# EAGLE design e21-hw (EAGLE 9.6.2)
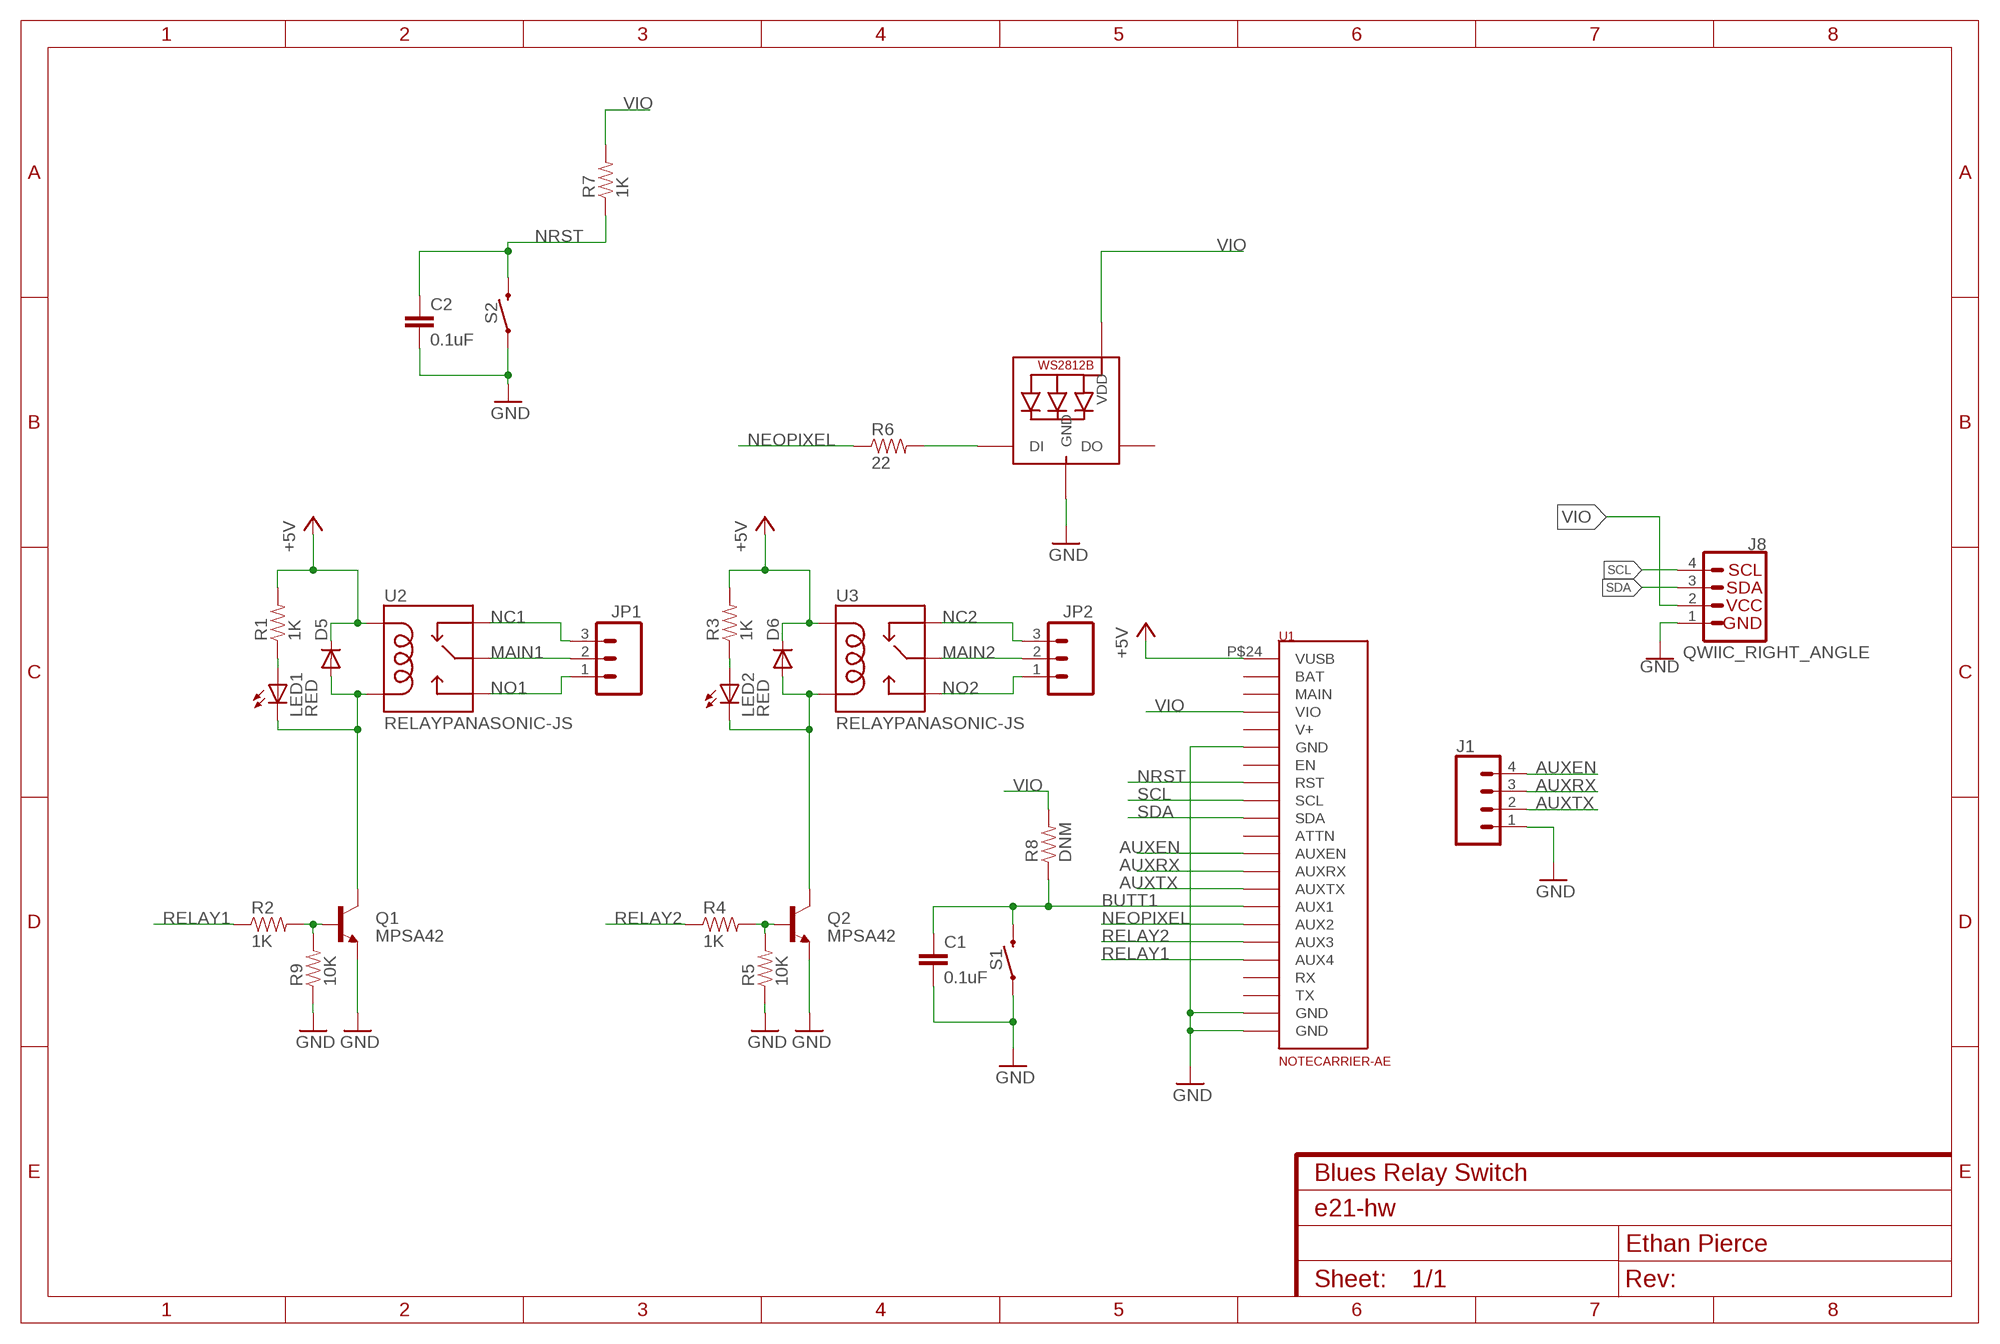
[diagram p0: schematic, sheet 1]
FRAME1 (FRAME-A4L): CNAME: Blues Relay Switch; DESIGNER: Ethan Pierce

## Parts
C1  0.1uF  0.1UF-0603-25V-(+80/-20%)  [0603]
C2  0.1uF  0.1UF-0603-25V-(+80/-20%)  [0603]
D5  DIODE-SOD123  [SOD123]
D6  DIODE-SOD123  [SOD123]
J1  CONN_04LOCK  [1X04_LOCK]
J8  QWIIC_RIGHT_ANGLE  QWIIC_CONNECTORJS-1MM  [JST04_1MM_RA]
JP1  M03-SCREW-5MM  [SCREWTERMINAL-5MM-3]
JP2  M03-SCREW-5MM  [SCREWTERMINAL-5MM-3]
LED1  RED  LED0603  [LED-0603]
LED2  RED  LED0603  [LED-0603]
LED3  WS2812B5050  [WS2812B]
Q1  MPSA42  TRANSISTOR_NPNMPSA42  [SOT23]
Q2  MPSA42  TRANSISTOR_NPNMPSA42  [SOT23]
R1  1K  RESISTOR0603-RES  [0603-RES]
R2  1K  RESISTOR0603-RES  [0603-RES]
R3  1K  RESISTOR0603-RES  [0603-RES]
R4  1K  RESISTOR0603-RES  [0603-RES]
R5  10K  RESISTOR0603-RES  [0603-RES]
R6  22  RESISTOR0603-RES  [0603-RES]
R7  1K  RESISTOR0603-RES  [0603-RES]
R8  DNM  RESISTOR0603-RES  [0603-RES]
R9  10K  RESISTOR0603-RES  [0603-RES]
S1  MOMENTARY-SWITCH-SPST-PTH-6.0MM  [TACTILE_SWITCH_PTH_6.0MM]
S2  MOMENTARY-SWITCH-SPST-PTH-6.0MM  [TACTILE_SWITCH_PTH_6.0MM]
U1  NOTECARRIER-AE  [NOTECARRIER-AE]
U2  RELAYPANASONIC-JS  [JS1-5V-F]
U3  RELAYPANASONIC-JS  [JS1-5V-F]

## Nets
+5V: D5.C D6.C R1.2 R3.2 U1.P$24(VUSB) U2.COIL1 U3.COIL1
AUXEN: J1.4 U1.P$11(AUXEN)
AUXRX: J1.3 U1.P$10(AUXRX)
AUXTX: J1.2 U1.P$9(AUXTX)
BUTT1: C1.1 R8.1 S1.3 U1.P$8(AUX1)
GND: C1.2 C2.2 J1.1 J8.1 LED3.3-GND(GND) Q1.2(E) Q2.2(E) R5.1 R9.1 S1.1 S2.1 U1.P$1(GND) U1.P$2(GND) U1.P$18(GND)
MAIN1: JP1.2 U2.COMMON(MAIN)
MAIN2: JP2.2 U3.COMMON(MAIN)
N$1: D5.A LED1.C Q1.3(C) U2.COIL2
N$2: Q2.1(B) R4.2 R5.2
N$3: Q1.1(B) R2.2 R9.2
N$4: LED1.A R1.1
N$5: D6.A LED2.C Q2.3(C) U3.COIL2
N$6: LED2.A R3.1
N$8: LED3.4-DIN(DI) R6.2
NC1: JP1.3 U2.CLOSED(NC)
NC2: JP2.3 U3.CLOSED(NC)
NEOPIXEL: R6.1 U1.P$7(AUX2)
NO1: JP1.1 U2.OPEN(NO)
NO2: JP2.1 U3.OPEN(NO)
NRST: C2.1 R7.1 S2.3 U1.P$16(RST)
RELAY1: R2.1 U1.P$5(AUX4)
RELAY2: R4.1 U1.P$6(AUX3)
SCL: J8.4 U1.P$14(SCL)
SDA: J8.3 U1.P$13(SDA)
VIO: J8.2 LED3.1-VDD(VDD) R7.2 R8.2 U1.P$21(VIO)
Unconnected: LED3.2-DOUT(DO) U1.P$3(TX) U1.P$4(RX) U1.P$12(ATTN) U1.P$17(EN) U1.P$19(V+) U1.P$22(MAIN) U1.P$23(BAT)

## Library data of the parts
C1 C2 = SparkFun-Capacitors:0.1UF: 0.1µF ceramic capacitors A capacitor is a passive two-terminal electrical component used to store electrical energy temporarily in an electric field.; PROD_ID: CAP-00810
D5 D6 = diode:DIODE-: DIODE
J1 = SparkFun-Connectors:CONN_04: Multi connection point. Often used as Generic Header-pin footprint for 0.1 inch spaced/style header connections On any of the 0.1 inch spaced packages, you can populate with these: Break Away Headers - Straight <https://www.sparkfun.com/products/116> (PRT-00116) Break Away Male Headers - Right Angle <https://www.sparkfun.com/products/553> (PRT-00553) Female Headers <https://www.sparkfun.com/products/115> (PRT-00115) Break Away Headers - Machine Pin <https://www.sparkfun.com/products/117> (PRT-00117) Break Away Female Headers - Swiss Machine Pin <https://www.sparkfun.com/products/743> (PRT-00743) For SCREWTERMINALS and SPRING TERMINALS visit here: Screw Terimnals on SparkFun.com <https://www.sparkfun.com/search/results?term=Screw+Terminals> (5mm/3.5mm/2.54mm spacing) This device is also useful as a general connection point to wire up your design to another part of your project. Our various solder wires solder well into these plated through hole pads. Hook-Up Wire - Assortment (Stranded, 22 AWG) <https://www.sparkfun.com/products/11375> (PRT-11375) Hook-Up Wire - Assortment (Solid Core, 22 AWG) <https://www.sparkfun.com/products/11367> (PRT-11367) View the entire wire category on our website here <https://www.sparkfun.com/categories/141> Special notes: Molex polarized connector foot print use with SKU : PRT-08231 with associated crimp pins and housings. 1MM SMD Version SKU: PRT-10208; PROD_ID: CONN-09696
J8 = SparkFun-Connectors:QWIIC_CONNECTOR: SparkFun I2C Standard Qwiic Connector An SMD 1mm pitch JST connector makes it easy and quick (get it? Qwiic?) to connect I2C devices to each other. The Qwiic system <http://www.sparkfun.com/qwiic> enables fast and solderless connection between popular platforms and various sensors and actuators. We carry 200mm <https://www.sparkfun.com/products/14204>, 100mm <https://www.sparkfun.com/products/14205>, 50mm <https://www.sparkfun.com/products/14206>, and breadboard friendly <https://www.sparkfun.com/products/14207> Qwiic cables. We also offer 10 pcs strips <https://www.sparkfun.com/products/14323> the SMD connectors.; PROD_ID: CONN-13694
JP1 JP2 = SparkFun-Connectors:M03: Header 3 Standard 3-pin 0.1" header. Use with straight break away headers (SKU : PRT-00116), right angle break away headers (PRT-00553), swiss pins (PRT-00743), machine pins (PRT-00117), and female headers (PRT-00115). Molex polarized connector foot print use with SKU : PRT-08232 with associated crimp pins and housings.
LED1 LED2 = SparkFun-LED:LED: LEDs Standard schematic elements and footprints for 5mm, 3mm, 1206, and 0603 sized LEDs. 5mm - Spark Fun Electronics SKU : COM-00529 (and others)
LED3 = adafruit:WS2812B
Q1 Q2 = SparkFun-DiscreteSemi:TRANSISTOR_NPN: Generic NPN BJT MMBT2222A - TRANS-08049 (SOT-23, 1A 40V) MPSA42 - TRANS-09116 (SOT-23, 500mA 300V) MMBT5088LT1G - TRANS-11160 (SOT-23, 50 mA 30V); PROD_ID: TRANS-09116
R1-R9 = SparkFun-Passives:RESISTOR: Resistor Basic schematic elements and footprints for 0603, 1206, and PTH resistors.
S1 S2 = SparkFun-Switches:MOMENTARY-SWITCH-SPST: Momentary Switch (Pushbutton) - SPST Normally-open (NO) SPST momentary switches (buttons, pushbuttons). Variants PTH-12MM - 12mm square, through-hole Momentary Pushbutton Switch - 12mm Square <https://www.sparkfun.com/products/9190> (COM-09190) PTH-6.0MM, PTH-6.0MM-KIT - 6.0mm square, through-hole Mini Pushbutton Switch <https://www.sparkfun.com/products/97> (COM-00097) KIT package intended for soldering kit's - only one side of pads' copper is exposed. PTH-RIGHT-ANGLE-KIT - Right-angle, through-hole Right Angle Tactile Button <https://www.sparkfun.com/products/10791> - Used on SparkFun BigTime Watch Kit <https://www.sparkfun.com/products/11734> SMD-12MM - 12mm square, surface-mount Tactile Button - SMD (12mm) <https://www.sparkfun.com/products/12993> (COM-12993) Used on SparkFun PicoBoard <https://www.sparkfun.com/products/11888> SMD-4.5MM - 4.5mm Square Trackball Switch Used on SparkFun Blackberry Trackballer Breakout <https://www.sparkfun.com/products/13169> SMD-4.6MMX2.8MM - 4.60mm x 2.80mm, surface mount Used on SparkFun SAMD21 Mini Breakout <https://www.sparkfun.com/products/13664> SMD-5.2MM, SMD-5.2-REDUNDANT - 5.2mm square, surface-mount Mini Pushbutton Switch - SMD <https://www.sparkfun.com/products/8720> (COM-08720) Used on Arduino Pro Mini <https://www.sparkfun.com/products/11114> REDUNDANT package connects both switch circuits together SMD-6.0X3.5MM - 6.0 x 3.5mm, surface mount Momentary Reset Switch SMD <https://www.sparkfun.com/products/8229> (COM-08229) SMD-6.2MM-TALL - 6.2mm square, surface mount Tactile Button - SMD (6mm) <https://www.sparkfun.com/products/12992> Used on SparkFun Digital Sandbox <https://www.sparkfun.com/products/12651> SMD-RIGHT-ANGLE - Right-angle, surface mount Used on SparkFun Block for Intel® Edison - Arduino <https://www.sparkfun.com/products/13036>; PROD_ID: SWCH-08441; SF_SKU: COM-00097
U1 = notecarrier-ae:NOTECARRIER-AE
U2 U3 = Spark:RELAY: SPDT relay (COM-00101)

## Board
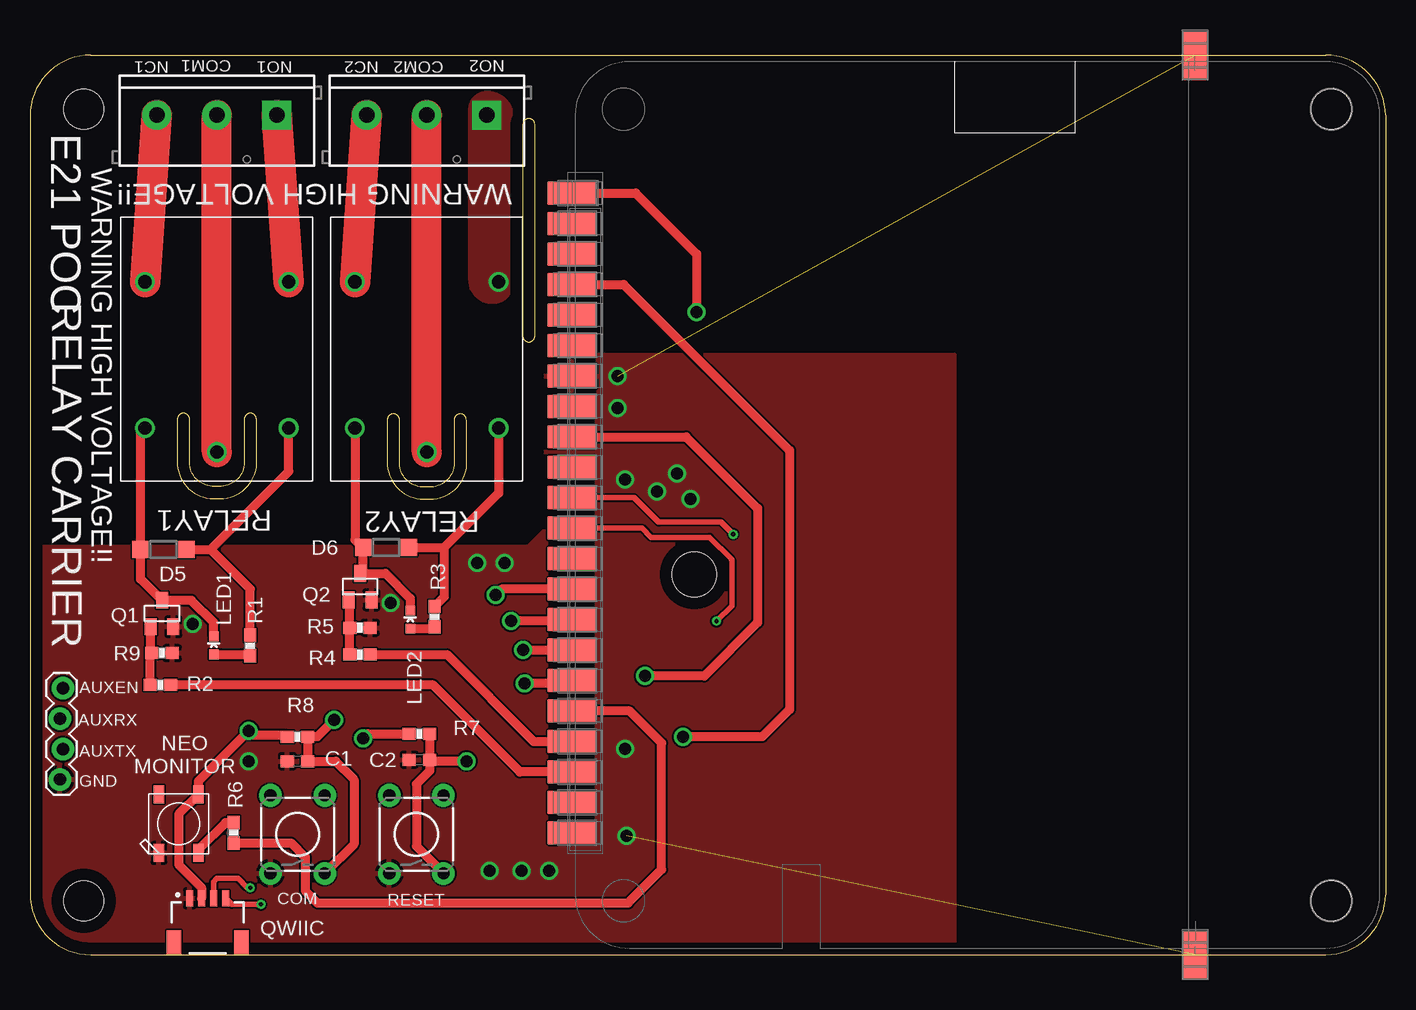
[diagram p1: board, top side]
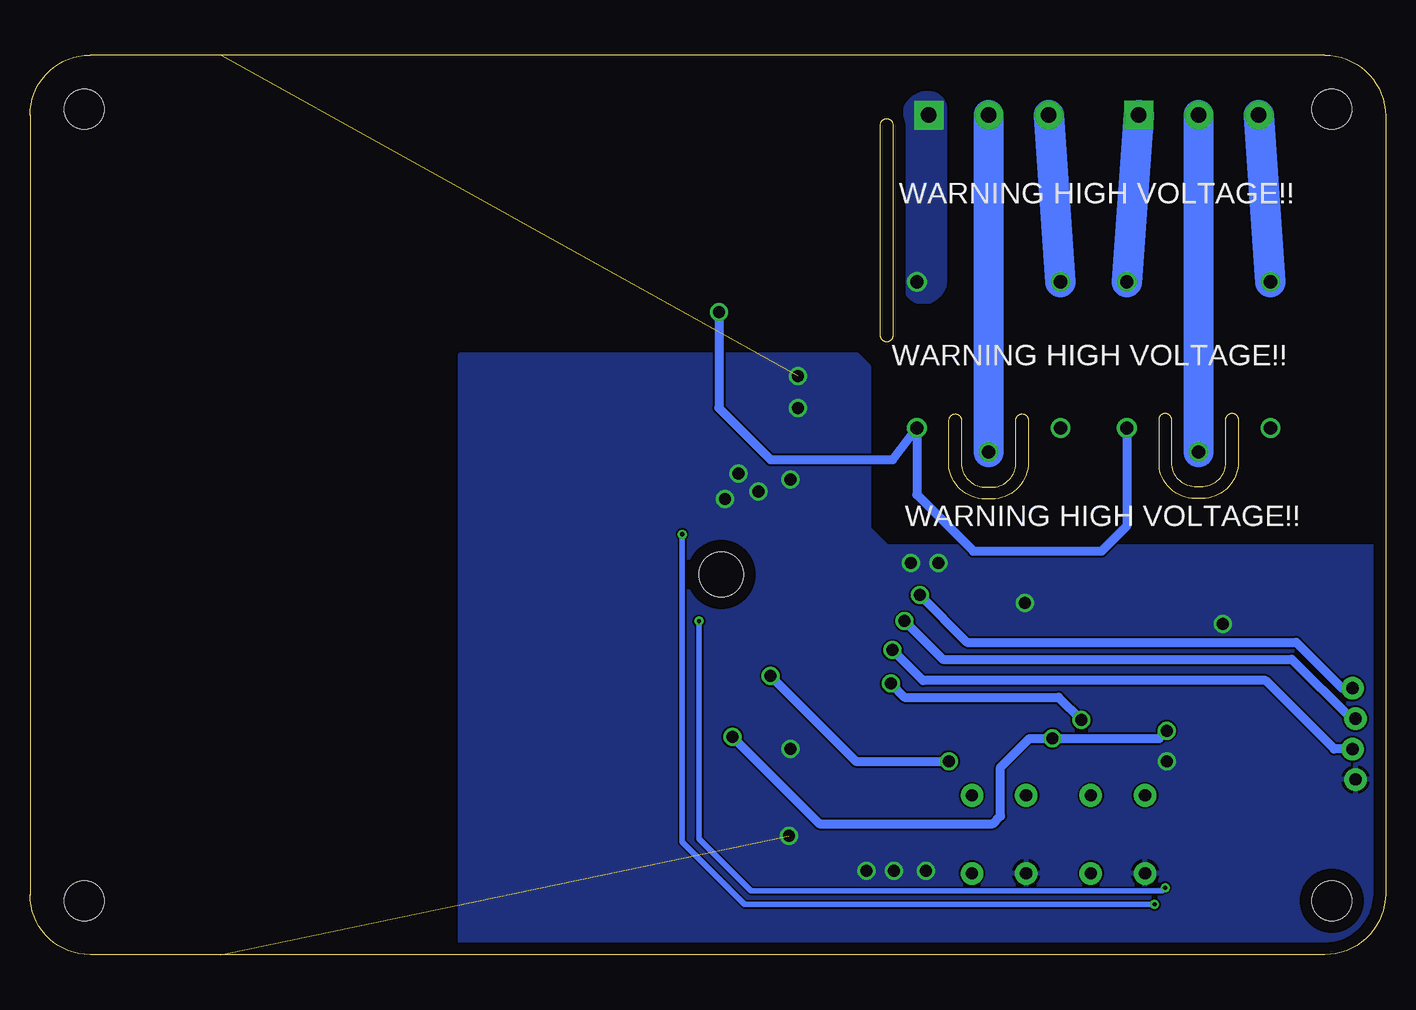
[diagram p2: board, bottom side, seen from below]

Size 113 x 75 mm. Coordinates in mm from the lower left corner, seen from the top.
Outline: 113,70 113,5 arc-90 108,0 5.08,0 arc-90 0,5.08 0,69.92 arc-90 5.08,75 108,75 arc-90 113,70
Outline: 17.86,44.64 17.86,40.83 arc-90 15.58,39.05 arc-90 13.3,40.83 13.3,44.64 arc180 12.29,44.64 12.29,40.83 arc90 15.58,38.04 arc85 18.88,40.58 18.88,44.64 arc180 17.86,44.64
Outline: 41.08,69.21 41.08,51.59 arc180 42.09,51.59 42.09,69.21 arc180 41.08,69.21
Outline: 35.36,44.59 35.36,40.78 arc-90 33.08,39 arc-90 30.8,40.78 30.8,44.59 arc180 29.79,44.59 29.79,40.78 arc90 33.08,37.99 arc85 36.38,40.53 36.38,44.59 arc180 35.36,44.59
Copper layers (1*16): Top 0.035mm / dielectric 1.5mm / Bottom 0.035mm
Design rules "default": minimum track width 6mil, minimum drill 0.35mm, track to track 6mil, track to pad 6mil, pad to pad 6mil, via to via 6mil, smd to smd 6mil, copper to edge 40mil, drill to drill 6mil, minimum pad ring 10mil, minimum via ring 8mil, stop-mask expansion 4mil, vias tented up to drill 0mil, thermal gap 10mil
Holes 3.3 mm at 108.48,70.5 108.48,4.5 4.48,4.5 4.48,70.5
Holes 3.7 mm at 55.38,31.7

### Footprints (pad centres in the part's own frame; a part is rotated, then mirrored left to right if it is on the bottom)
0603 = smd 1.1 x 1: 1 -0.85,0; 2 0.85,0
SOD123 = smd 1.4 x 1.4: A 1.9,0; C -1.9,0
1X04_LOCK = drill 1.016 pad 1.88: 1 0,0.127; 2 2.54,-0.127; 3 5.08,0.127; 4 7.62,-0.127
JST04_1MM_RA = smd 0.6 x 1.35: 1 -1.5,0; 2 -0.5,0; 3 0.5,0; 4 1.5,0 | smd 1.2 x 2: NC1 2.8,-3.675; NC2 -2.8,-3.675
SCREWTERMINAL-5MM-3 = drill 1.3 pad 2.413 square: 1 0,0 | drill 1.3 pad 2.413: 2 5,0; 3 10,0
LED-0603 = smd 0.8 x 0.8: A 0,-0.75; C 0,0.75
WS2812B = smd 1.5 x 0.9: 1-VDD 2.45,-1.65; 2-DOUT 2.45,1.65; 3-GND -2.45,1.65; 4-DIN -2.45,-1.65
SOT23 = smd 1 x 1.4: 1 -0.95,-1.1; 2 0.95,-1.1; 3 0,1.1
0603-RES = smd 1.1 x 1: 1 -0.85,0; 2 0.85,0
TACTILE_SWITCH_PTH_6.0MM = drill 1.016 pad 1.88: 1 -3.251,2.261; 2 3.251,2.261; 3 -3.251,-2.261; 4 3.251,-2.261
NOTECARRIER-AE = smd 4 x 1.94: P$1 0.5,51.63; P$2 -74.5,51.63 | smd 1.94 x 4: P$3 -9.66,-0.35; P$4 -12.2,-0.35; P$5 -14.74,-0.35; P$6 -17.28,-0.35; P$7 -19.82,-0.35; P$8 -22.36,-0.35; P$9 -24.9,-0.35; P$10 -27.44,-0.35; P$11 -29.98,-0.35; P$12 -32.52,-0.35; P$13 -35.06,-0.35; P$14 -37.6,-0.35; P$15 -40.14,-0.35; P$16 -42.68,-0.35; P$17 -45.22,-0.35; P$18 -47.76,-0.35; P$19 -50.3,-0.35; P$20 -52.84,-0.35; P$21 -55.38,-0.35; P$22 -57.92,-0.35; P$23 -60.46,-0.35; P$24 -63,-0.35
JS1-5V-F = drill 1.1: CLOSED -6.096,-5.994; COIL1 6.096,5.994; COIL2 6.096,-5.994; COMMON 8.103,0; OPEN -6.096,5.994

### Placement (x,y rotation side)
C1  22.3,16.13 180 top
C2  32.46,16.26 180 top
D5  11.13,33.78 180 top
D6  29.69,33.94 180 top
J1  2.62,14.61 90 top
J8  14.81,4.7 0 top
JP1  20.58,70 180 top
JP2  38.08,70 180 top
LED1  15.32,25.78 0 top
LED2  31.7,27.94 0 top
LED3  12.4,10.92 90 top
Q1  11,28.45 0 top
Q2  27.51,30.69 0 top
R1  18.37,25.78 90 top
R2  10.88,22.48 180 top
R3  33.73,28.19 90 top
R4  27.51,25.02 180 top
R5  27.51,27.26 180 top
R6  16.97,10.16 90 top
R7  32.46,18.41 180 top
R8  22.3,18.16 180 top
R9  11,25.15 180 top
S1  22.3,10.03 90 top
S2  32.21,10.03 90 top
U1  45.49,0.5 270 top
U2  15.58,50 270 top
U3  33.08,50 270 top

### Tracks (layer width: path | path; a pad name or v marks a point on that pad's centre or on a via)
+5V  (via drill 1)
  Top 0.762: U1.P$24 50.5,63.5 55.58,58.42 v55.58,53.59 | D5.C 15.07,33.78 | R1.2 18.37,30.48 15.07,33.78 | D6.C 34.53,33.94 | 34.53,33.94 34.53,29.84 R3.2 | U3.COIL1 39.07,38.49 34.53,33.94 | U2.COIL1 21.57,40.29 15.07,33.78
  Bottom 0.762: v55.58,53.59 55.58,45.59 51.26,41.27 41.06,41.27 U3.COIL1 39.07,38.36 34.37,33.66 23.65,33.66 21.57,35.73 U2.COIL1
AUXEN  (via drill 1)
  Top 0.762: v38.81,29.97 39.32,30.48 U1.P$11
  Bottom 0.762: v38.81,29.97 34.88,26.04 7.45,26.04 3.64,22.23 J1.4
AUXRX  (via drill 1)
  Top 0.762: U1.P$10 45.01,27.81 v40.09,27.81
  Bottom 0.762: v40.09,27.81 36.91,24.64 7.83,24.64 2.87,19.68 J1.3
AUXTX  (via drill 1)
  Top 0.762: v41.1,25.4 U1.P$9
  Bottom 0.762: J1.2 4.27,17.14 9.99,22.86 38.56,22.86 v41.1,25.4
BUTT1  (via drill 1)
  Top 0.762: U1.P$8 44.89,22.61 v41.23,22.61 | v25.35,19.56 23.96,18.16 R8.1 C1.1 25.48,16.13 27,14.61 27,9.22 S1.3
  Bottom 0.762: v41.23,22.61 40.09,21.46 27.26,21.46 v25.35,19.56
GND  (via drill 1)  (2 unrouted)
  other vias: 48.98,48.26 48.98,45.59 30.05,29.34 13.54,27.56 38.31,6.99 40.97,6.99 43.26,6.99 49.74,9.91 49.61,17.14 39.58,32.64 37.29,32.64 49.61,39.62 52.28,38.61 55.07,37.97 53.93,40.13 18.22,16.1
  pour Top: 0.08,34 41.58,34 43.08,35.5 43.08,49 44.08,50 77.03,50 77.03,-1 3.58,-1 -0.42,3 -0.42,33.5
  pour Bottom: 0.08,34 41.58,34 43.08,35.5 43.08,49 44.08,50 77.13,50 77.13,-1 3.58,-1 -0.42,3 -0.42,33.5
MAIN1
  Top 2.489: U2.COMMON JP1.2
  Bottom 2.489: U2.COMMON JP1.2
MAIN2
  Top 2.489: U3.COMMON JP2.2
  Bottom 2.489: U3.COMMON JP2.2
N$1
  Top 0.762: LED1.C 15.32,27.69 13.46,29.55 Q1.3 9.23,31.32 D5.A 9.23,43.55 U2.COIL2
N$2
  Top 0.762: R4.2 R5.2 26.66,29.49 Q2.1
N$3
  Top 0.762: R2.2 10.03,25.02 R9.2 10.05,25.25 Q1.1
N$4
  Top 0.762: LED1.A 18.27,25.03 R1.1
N$5
  Top 0.406: 27.75,33.91 D6.A
  Top 0.762: LED2.C 31.7,29.72 29.63,31.79 Q2.3 27.75,32.03 27.75,33.91 27.09,34.58 U3.COIL2
N$6
  Top 0.762: LED2.A 33.58,27.19 R3.1
N$8
  Top 0.762: R6.2 16.31,11.01 14.14,8.85 14.14,8.56 LED3.4-DIN
NC1
  Top 2.54: U2.CLOSED JP1.3
  Bottom 2.54: U2.CLOSED JP1.3
NC2
  Top 2.54: U3.CLOSED JP2.3
  Bottom 2.54: U3.CLOSED JP2.3
NEOPIXEL
  Top 0.762: U1.P$7 49.99,20.32 52.66,17.65 52.66,7.11 49.86,4.32 23.96,4.32 22.94,5.33 22.94,8.13 21.76,9.31 R6.1
NO1
  Top 2.54: U2.OPEN JP1.1
  Bottom 2.54: U2.OPEN JP1.1
NO2
  pour Bottom (no thermals): 36.91,70.48 arc-90 38.05,71.63 38.18,71.63 arc-90 39.96,69.85 39.96,56.01 arc-90 38.56,54.61 arc-90 36.91,56.26
  pour Top (no thermals): 36.91,70.48 arc-90 38.05,71.63 38.18,71.63 arc-90 39.96,69.85 39.96,56.01 arc-90 38.56,54.61 arc-90 36.91,56.26
NRST  (via drill 1)
  Top 0.762: U1.P$16 54.69,43.18 60.66,37.21 60.66,27.69 56.21,23.24 v51.26,23.24 | v36.4,16.13 33.44,16.13 C2.1 | R7.1 C2.1 | C2.1 33.31,15.33 32.21,14.22 32.21,9.04 S2.3
  Bottom 0.762: v51.26,23.24 44.15,16.13 v36.4,16.13
RELAY1
  Top 0.762: U1.P$5 40.85,15.24 33.61,22.48 R2.1
RELAY2
  Top 0.762: U1.P$6 41.99,17.78 34.75,25.02 R4.1
SCL  (via drill 0.35)
  Top 0.457: U1.P$14 50.37,38.1 52.4,36.07 57.61,36.07 v58.63,35.05 | v19.26,4.19 16.82,4.19 J8.4
  Bottom 0.457: v58.63,35.05 58.63,9.4 53.42,4.19 v19.26,4.19
SDA  (via drill 0.35)
  Top 0.457: v57.23,27.81 58.5,29.08 58.5,32.89 58.48,32.92 58.48,32.98 56.66,34.8 51.77,34.8 51.01,35.56 U1.P$13 | v18.37,5.59 18.11,5.59 17.35,6.35 15.57,6.35 15.31,6.09 J8.3
  Bottom 0.457: v57.23,27.81 57.23,9.65 52.91,5.33 18.62,5.33 v18.37,5.59
VIO  (via drill 1)
  Top 0.762: U1.P$21 49.48,55.88 63.33,42.04 63.33,20.45 61.04,18.16 v54.44,18.16 | v27.77,18.03 28.15,18.41 R7.2 | R8.2 21.33,18.29 18.62,18.29 v18.24,18.67 14.05,14.48 LED3.1-VDD 12.4,11.72 12.4,7.49 14.31,5.58 J8.2
  Bottom 0.762: v54.44,18.16 47.2,10.92 32.72,10.92 32.08,11.56 32.08,15.62 29.67,18.03 v27.77,18.03 18.88,18.03 v18.24,18.67

### Text on the board
tPlace: COM1 | NO2 | NC1 | NO1 | NC2 | COM2 | WARNING HIGH VOLTAGE!! | E21 POC | WARNING HIGH VOLTAGE!! | RELAY CARRIER | RELAY1 | RELAY2 | AUXEN | AUXRX | AUXTX | NEO / MONITOR | GND | COM | RESET | QWIIC
bPlace: WARNING HIGH VOLTAGE!! | WARNING HIGH VOLTAGE!! | WARNING HIGH VOLTAGE!!